# Altium schematic sheet temp.SchDoc
size A4
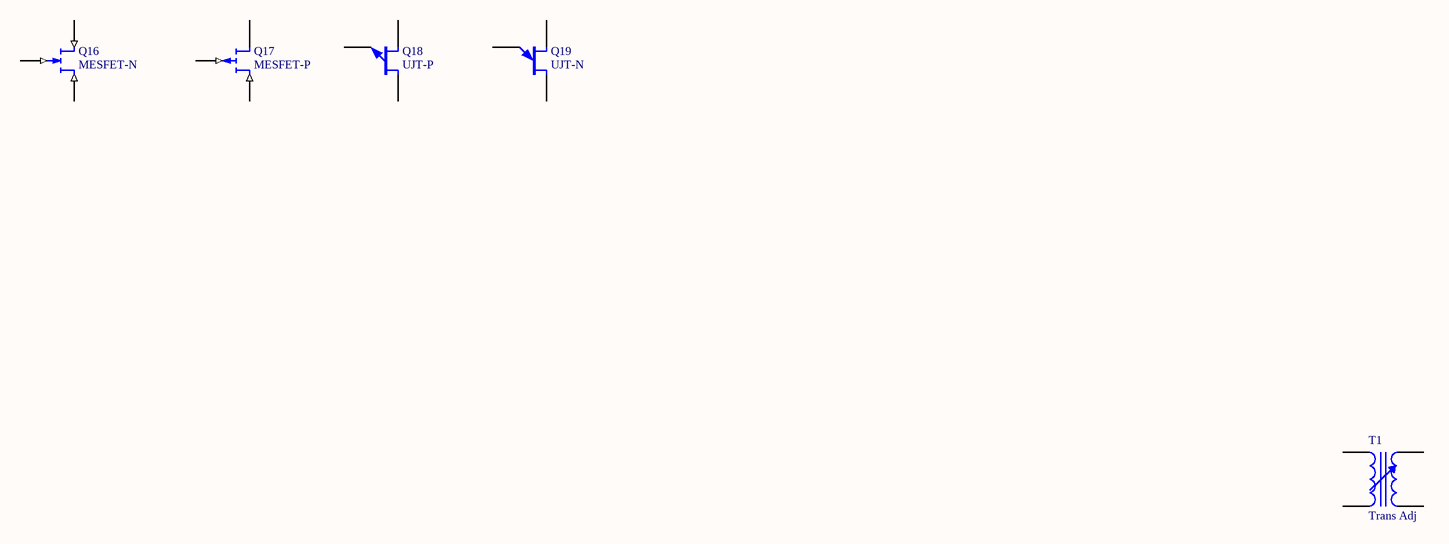
[diagram p0: temp.SchDoc]

## Parts
Q16  MESFET-N  [TO-18]
Q17  MESFET-P  [TO-18]
Q18  UJT-P  [TO-205AF]
Q19  UJT-N  [TO-39]
T1  Trans Adj  [TRF_4]

## Nets

Not connected (* = marked no-connect by the designer): Q16 1(D) 2(G) 3(S); Q17 1(D) 2(G) 3(S); Q18 1(E) 2(B1) 3(B2); Q19 1(E) 2(B1) 3(B2); T1 1 2 3 4

## Library data of the parts
Q16 = MESFET-N: N-Channel MESFET; Published: 8-Jun-2000; LatestRevisionDate: 17-Jul-2002; LatestRevisionNote: Re-released for DXP Platform.; PackageReference: TO-18; Publisher: Altium Limited; PackageDescription: Can; 3 Leads; Pin Circle Dia. 2.54 mm; Lead Dia. 0.48 mm (max); Code_JEDEC: TO-18
Q17 = MESFET-P: P-Channel MESFET; Published: 8-Jun-2000; LatestRevisionDate: 17-Jul-2002; LatestRevisionNote: Re-released for DXP Platform.; PackageReference: TO-18; Publisher: Altium Limited; PackageDescription: Can; 3 Leads; Pin Circle Dia. 2.54 mm; Lead Dia. 0.48 mm (max); Code_JEDEC: TO-18
Q18 = UJT-P: Unijunction Transistor with P-Type Base; Published: 24-Mar-1999; LatestRevisionDate: 17-Jul-2002; LatestRevisionNote: Re-released for DXP Platform.; PackageReference: TO-205AF; Publisher: Altium Limited; PackageDescription: Can; 3 Leads; Pin Circle Dia. 5.08 mm; Lead Dia. 0.53 mm (max); Code_JEDEC: TO-205-AF
Q19 = UJT-N: Unijunction Transistor with N-Type Base; Published: 8-Jun-2000; LatestRevisionDate: 17-Jul-2002; LatestRevisionNote: Re-released for DXP Platform.; PackageReference: TO-39; Publisher: Altium Limited; PackageDescription: Can; 3 Leads; Pin Circle Dia. 5.08 mm; Lead Dia. 0.48 mm (max); Code_JEDEC: TO-205-AF
T1 = Trans Adj: Variable Transformer; Published: 24-Mar-1999; LatestRevisionDate: 17-Jul-2002; LatestRevisionNote: Re-released for DXP Platform.; PackageReference: TRF_4; Publisher: Altium Limited; PackageDescription: Transformer; 4 Leads